# EAGLE design traffic_signals (EAGLE 9.6.2)
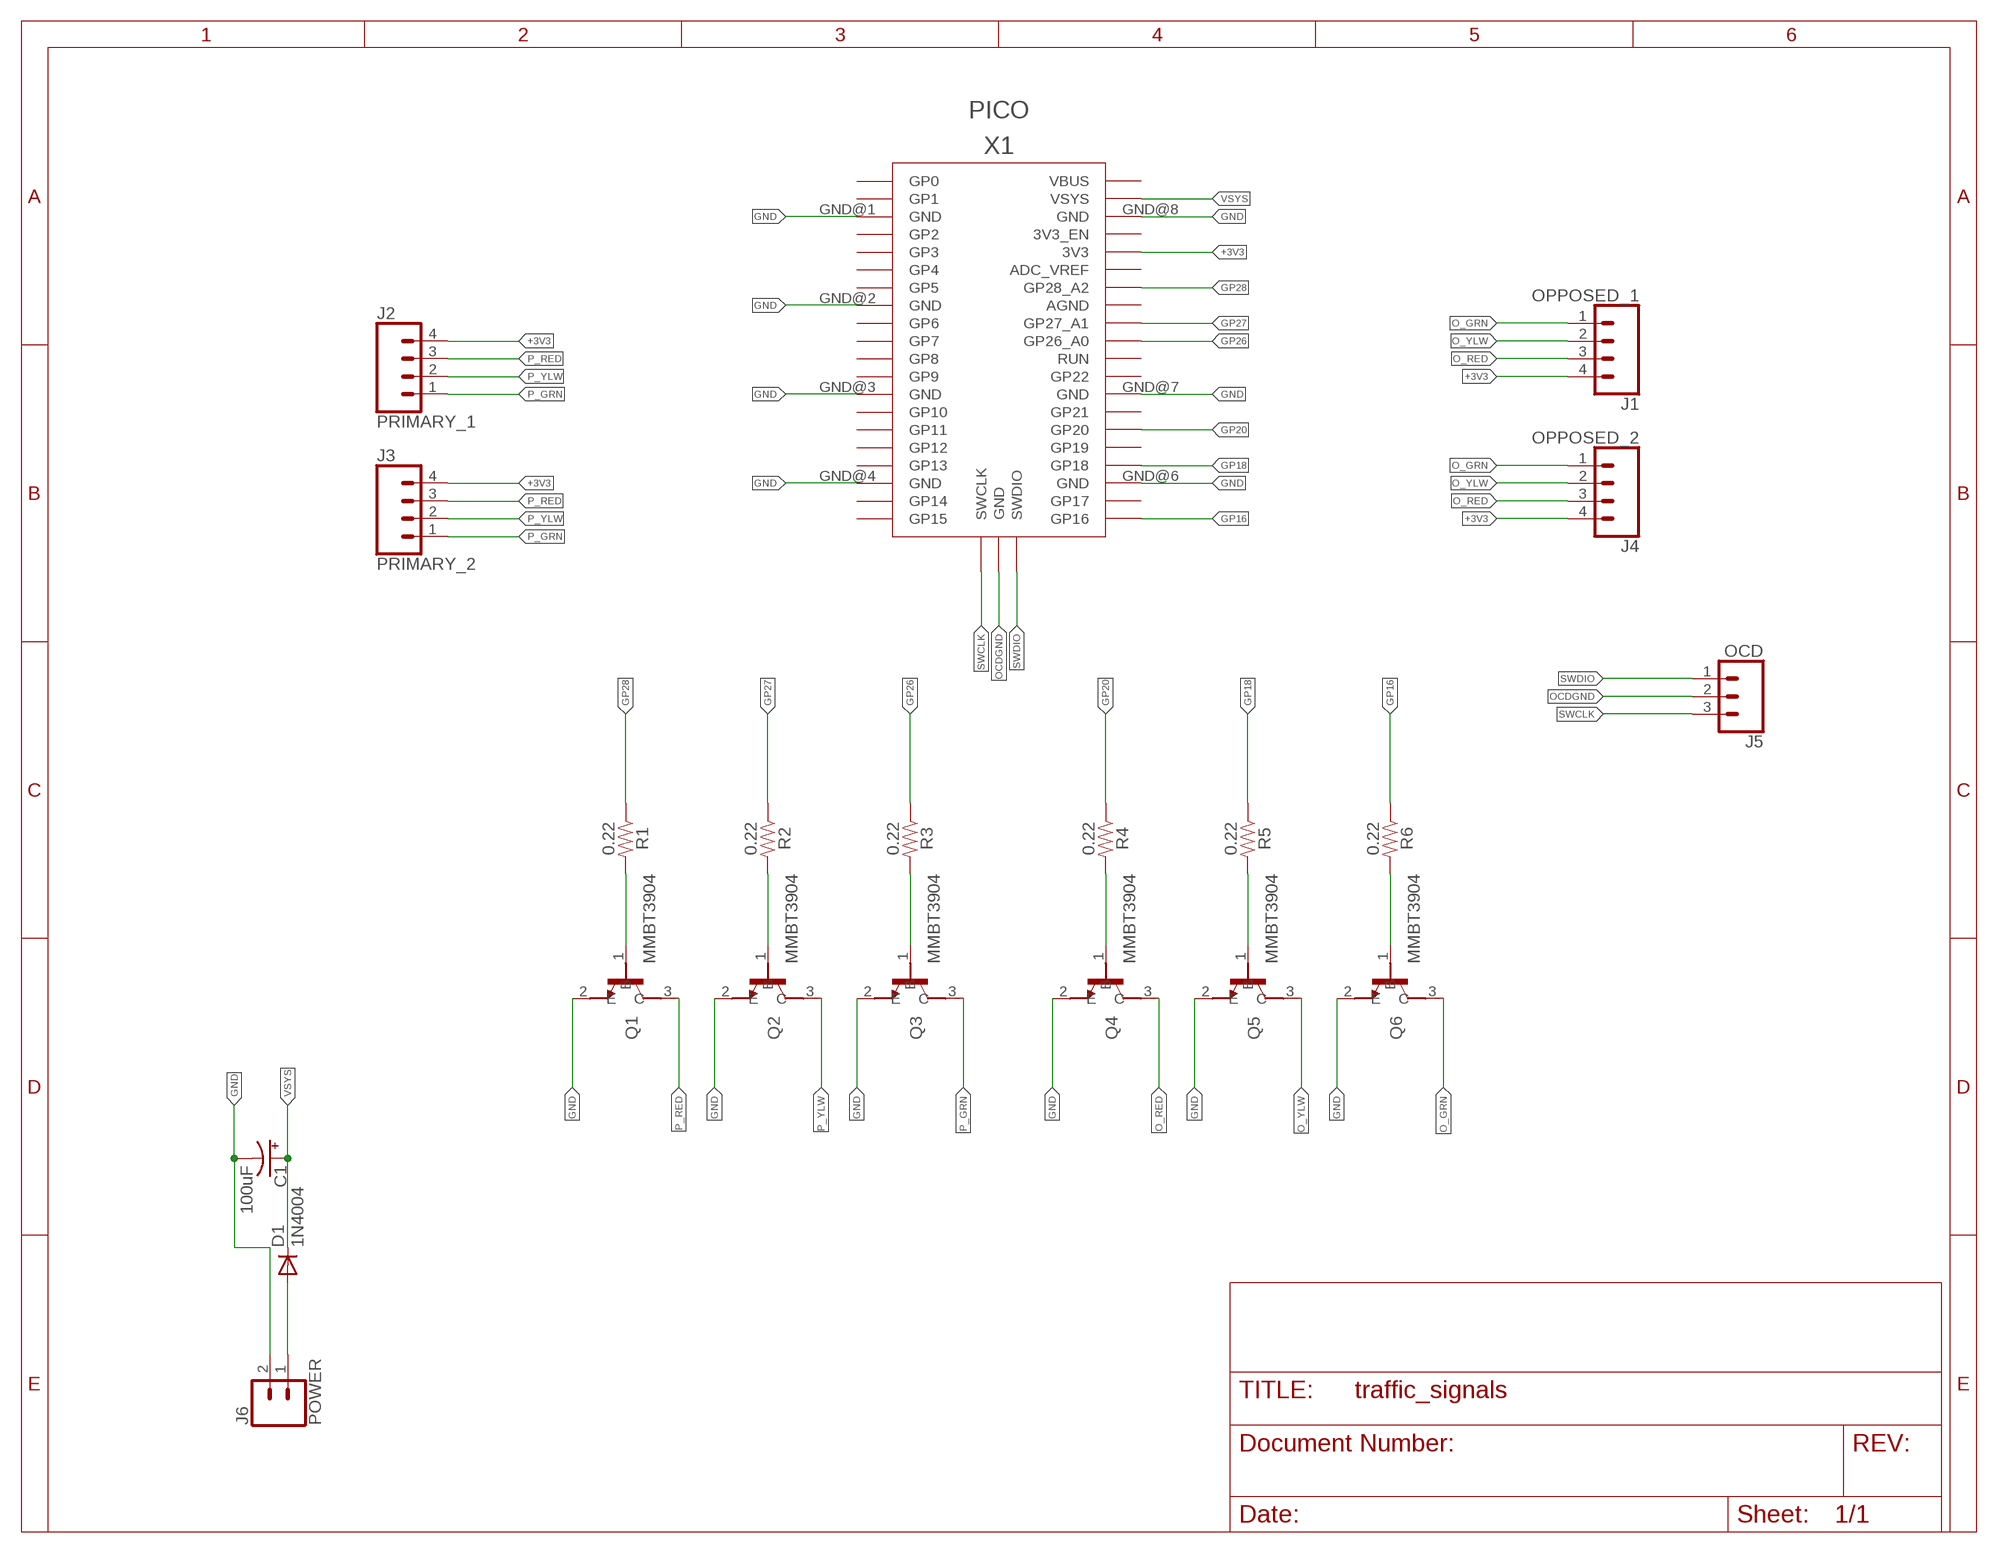
[diagram p0: schematic, sheet 1]

## Parts
C1  100uF  100UF-POLAR-RADIAL-2.5MM-25V-20%  [CPOL-RADIAL-2.5MM-6.5MM]
D1  1N4004  [DO41-10]
J1  OPPOSED_1  CONN_04  [1X04]
J2  PRIMARY_1  CONN_04  [1X04]
J3  PRIMARY_2  CONN_04  [1X04]
J4  OPPOSED_2  CONN_04  [1X04]
J5  OCD  CONN_03  [1X03]
J6  POWER  CONN_02  [1X02]
Q1  MMBT3904  [SOT95P240X120-3N]
Q2  MMBT3904  [SOT95P240X120-3N]
Q3  MMBT3904  [SOT95P240X120-3N]
Q4  MMBT3904  [SOT95P240X120-3N]
Q5  MMBT3904  [SOT95P240X120-3N]
Q6  MMBT3904  [SOT95P240X120-3N]
R1  0.22  0.22OHM-0805-1/4W-1%  [0805]
R2  0.22  0.22OHM-0805-1/4W-1%  [0805]
R3  0.22  0.22OHM-0805-1/4W-1%  [0805]
R4  0.22  0.22OHM-0805-1/4W-1%  [0805]
R5  0.22  0.22OHM-0805-1/4W-1%  [0805]
R6  0.22  0.22OHM-0805-1/4W-1%  [0805]
X1  PICO  RPI_PICO_IG-TH  [RPI_PICO_TH]

## Nets
+3V3: J1.4 J2.4 J3.4 J4.4 X1.3V3
GND: C1.2(-) J6.2 Q1.2(E) Q2.2(E) Q3.2(E) Q4.2(E) Q5.2(E) Q6.2(E) X1.GND@1(GND) X1.GND@2(GND) X1.GND@3(GND) X1.GND@4(GND) X1.GND@6(GND) X1.GND@7(GND) X1.GND@8(GND)
GP16: R6.1 X1.GP16
GP18: R5.1 X1.GP18
GP20: R4.1 X1.GP20
GP26: R3.1 X1.GP26_A0
GP27: R2.1 X1.GP27_A1
GP28: R1.1 X1.GP28_A2
N$2: D1.A J6.1
N$7: Q1.1(B) R1.2
N$8: Q2.1(B) R2.2
N$9: Q3.1(B) R3.2
N$10: Q4.1(B) R4.2
N$11: Q5.1(B) R5.2
N$12: Q6.1(B) R6.2
O_GRN: J1.1 J4.1 Q6.3(C)
O_RED: J1.3 J4.3 Q4.3(C)
O_YLW: J1.2 J4.2 Q5.3(C)
OCDGND: J5.2 X1.GND@5(GND)
P_GRN: J2.1 J3.1 Q3.3(C)
P_RED: J2.3 J3.3 Q1.3(C)
P_YLW: J2.2 J3.2 Q2.3(C)
SWCLK: J5.3 X1.SWCLK
SWDIO: J5.1 X1.SWDIO
VSYS: C1.1(+) D1.C X1.VSYS
Unconnected: X1.3V3_EN X1.ADC_VREF X1.AGND X1.GP0 X1.GP1 X1.GP2 X1.GP3 X1.GP4 X1.GP5 X1.GP6 X1.GP7 X1.GP8 X1.GP9 X1.GP10 X1.GP11 X1.GP12 X1.GP13 X1.GP14 X1.GP15 X1.GP17 X1.GP19 X1.GP21 X1.GP22 X1.RUN X1.VBUS

## Library data of the parts
C1 = SparkFun-Capacitors:100UF-POLAR: 100µF polarized capacitors A capacitor is a passive two-terminal electrical component used to store electrical energy temporarily in an electric field.; PROD_ID: CAP-08439
D1 = adafruit:1N4004: DIODE General purpose 1N400x type rectifier (With bigger pads) http://www.ladyada.net/library/pcb/eaglelibrary.html
J1-J4 = SparkFun-Connectors:CONN_04: Multi connection point. Often used as Generic Header-pin footprint for 0.1 inch spaced/style header connections On any of the 0.1 inch spaced packages, you can populate with these: Break Away Headers - Straight <https://www.sparkfun.com/products/116> (PRT-00116) Break Away Male Headers - Right Angle <https://www.sparkfun.com/products/553> (PRT-00553) Female Headers <https://www.sparkfun.com/products/115> (PRT-00115) Break Away Headers - Machine Pin <https://www.sparkfun.com/products/117> (PRT-00117) Break Away Female Headers - Swiss Machine Pin <https://www.sparkfun.com/products/743> (PRT-00743) For SCREWTERMINALS and SPRING TERMINALS visit here: Screw Terimnals on SparkFun.com <https://www.sparkfun.com/search/results?term=Screw+Terminals> (5mm/3.5mm/2.54mm spacing) This device is also useful as a general connection point to wire up your design to another part of your project. Our various solder wires solder well into these plated through hole pads. Hook-Up Wire - Assortment (Stranded, 22 AWG) <https://www.sparkfun.com/products/11375> (PRT-11375) Hook-Up Wire - Assortment (Solid Core, 22 AWG) <https://www.sparkfun.com/products/11367> (PRT-11367) View the entire wire category on our website here <https://www.sparkfun.com/categories/141> Special notes: Molex polarized connector foot print use with SKU : PRT-08231 with associated crimp pins and housings. 1MM SMD Version SKU: PRT-10208; PROD_ID: CONN-09696
J5 = SparkFun-Connectors:CONN_03: Multi connection point. Often used as Generic Header-pin footprint for 0.1 inch spaced/style header connections On any of the 0.1 inch spaced packages, you can populate with these: Break Away Headers - Straight <https://www.sparkfun.com/products/116> (PRT-00116) Break Away Male Headers - Right Angle <https://www.sparkfun.com/products/553> (PRT-00553) Female Headers <https://www.sparkfun.com/products/115> (PRT-00115) Break Away Headers - Machine Pin <https://www.sparkfun.com/products/117> (PRT-00117) Break Away Female Headers - Swiss Machine Pin <https://www.sparkfun.com/products/743> (PRT-00743) Stackable Header - 3 Pin (Female, 0.1") <https://www.sparkfun.com/products/13875> (PRT-13875) For SCREWTERMINALS and SPRING TERMINALS visit here: Screw Terimnals on SparkFun.com <https://www.sparkfun.com/search/results?term=Screw+Terminals> (5mm/3.5mm/2.54mm spacing) This device is also useful as a general connection point to wire up your design to another part of your project. Our various solder wires solder well into these plated through hole pads. Hook-Up Wire - Assortment (Stranded, 22 AWG) <https://www.sparkfun.com/products/11375> (PRT-11375) Hook-Up Wire - Assortment (Solid Core, 22 AWG) <https://www.sparkfun.com/products/11367> (PRT-11367) View the entire wire category on our website here <https://www.sparkfun.com/categories/141> Special notes: Molex polarized connector foot print use with SKU : PRT-08232 with associated crimp pins and housings.
J6 = SparkFun-Connectors:CONN_02: Multi connection point. Often used as Generic Header-pin footprint for 0.1 inch spaced/style header connections On any of the 0.1 inch spaced packages, you can populate with these: Break Away Headers - Straight <https://www.sparkfun.com/products/116> (PRT-00116) Break Away Male Headers - Right Angle <https://www.sparkfun.com/products/553> (PRT-00553) Female Headers <https://www.sparkfun.com/products/115> (PRT-00115) Break Away Headers - Machine Pin <https://www.sparkfun.com/products/117> (PRT-00117) Break Away Female Headers - Swiss Machine Pin <https://www.sparkfun.com/products/743> (PRT-00743) For SCREWTERMINALS and SPRING TERMINALS visit here: Screw Terimnals on SparkFun.com <https://www.sparkfun.com/search/results?term=Screw+Terminals> (5mm/3.5mm/2.54mm spacing) This device is also useful as a general connection point to wire up your design to another part of your project. Our various solder wires solder well into these plated through hole pads. Hook-Up Wire - Assortment (Stranded, 22 AWG) <https://www.sparkfun.com/products/11375> (PRT-11375) Hook-Up Wire - Assortment (Solid Core, 22 AWG) <https://www.sparkfun.com/products/11367> (PRT-11367) View the entire wire category on our website here <https://www.sparkfun.com/categories/141> Special notes: Molex polarized connector foot print use with: PRT-08233 with associated crimp pins and housings. 2.54_SCREWTERM for use with PRT-10571. 3.5mm Screw Terminal footprints for PRT-08084 5mm Screw Terminal footprints for use with PRT-08432
Q1-Q6 = MMBT3904:MMBT3904: MMBT3904 Series 40 V CE Breakdown 0.2 A NPN General Purpose Amplifier - SOT-23 Check prices <https://pricing.snapeda.com/parts/MMBT3904/STMicroelectronics/view-part?ref=eda>; AVAILABILITY: Bad; DESCRIPTION: Bipolar (BJT) Transistor NPN 40V 200mA 300MHz 300mW Surface Mount SOT-23-3; MF: STMicroelectronics; MP: MMBT3904; PACKAGE: SOT-23-3 Taiwan Semiconductor; PRICE: None
R1-R6 = SparkFun-Resistors:0.22OHM: 0.22Ω resistor A resistor is a passive two-terminal electrical component that implements electrical resistance as a circuit element. Resistors act to reduce current flow, and, at the same time, act to lower voltage levels within circuits. - Wikipedia; PROD_ID: RES-09883
X1 = RaspberryPi_Pico:RPI_PICO_IG

## Board
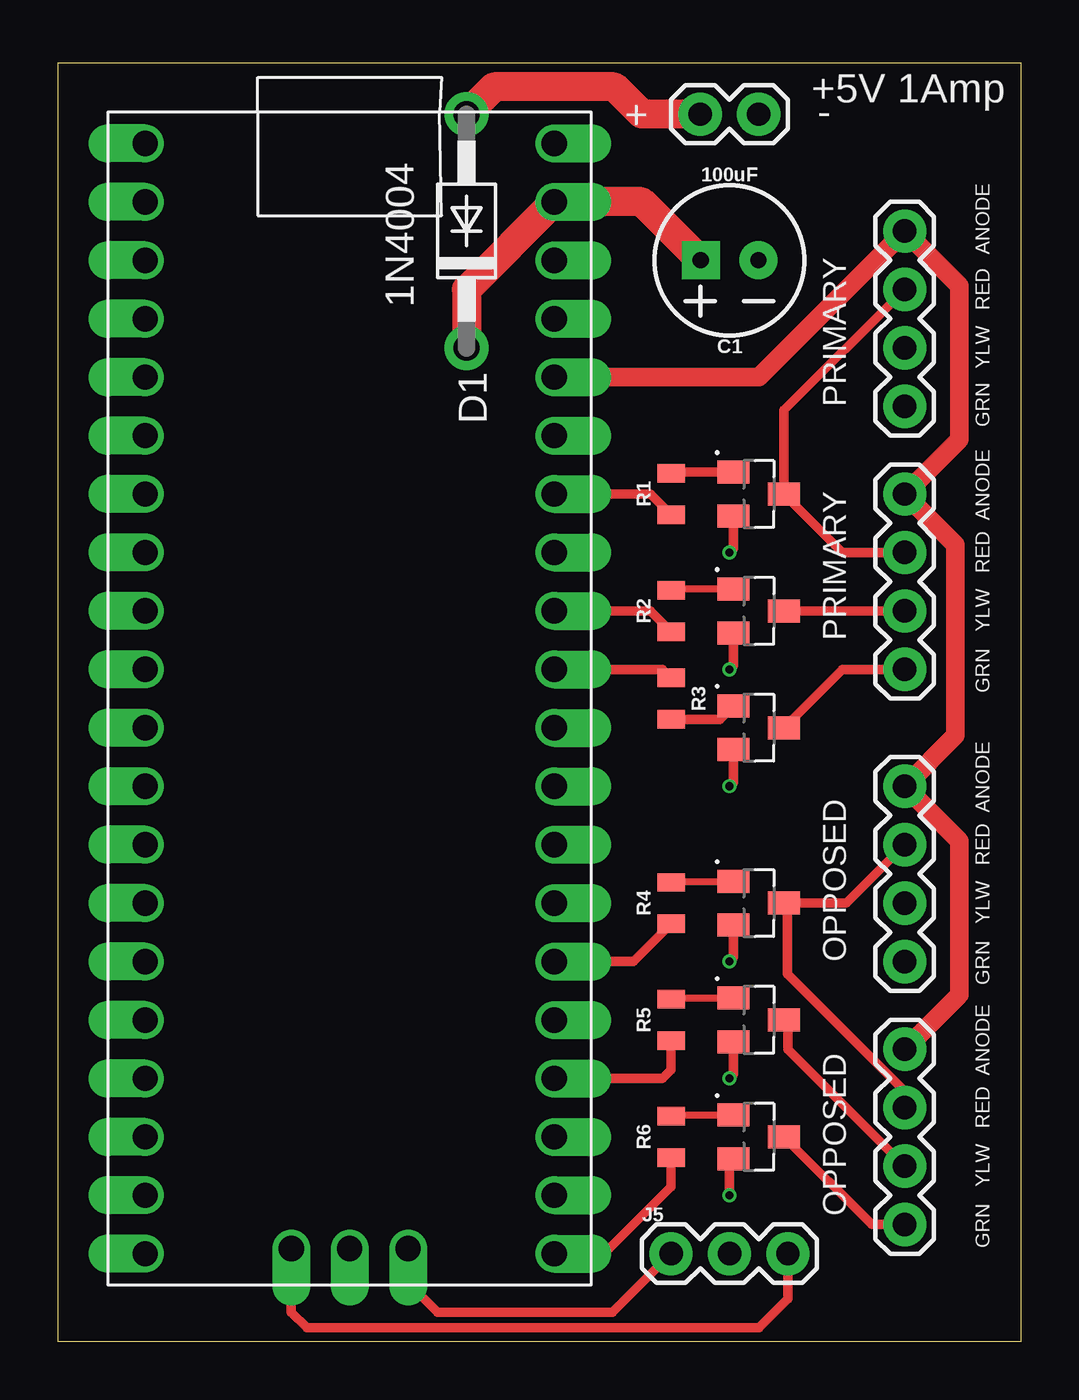
[diagram p1: board, top side]
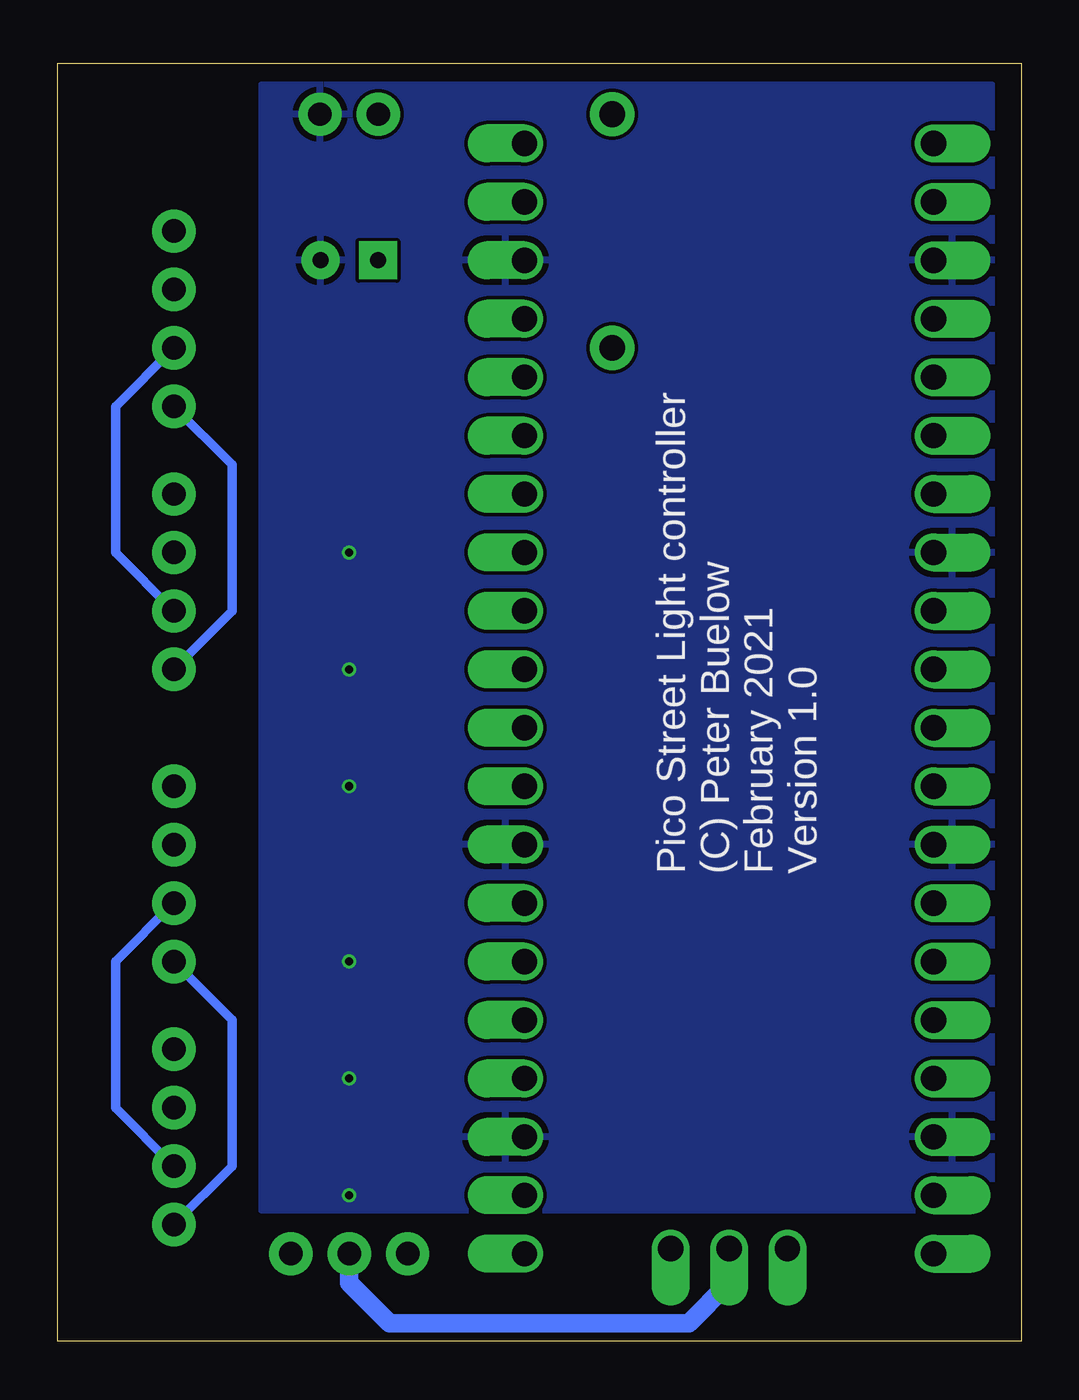
[diagram p2: board, bottom side, seen from below]

Size 41.89 x 55.55 mm. Coordinates in mm from the lower left corner, seen from the top.
Outline: 0,0 41.89,0 41.89,55.55 0,55.55 0,0
Copper layers (1*16): Top 0.035559375mm / dielectric 1.6mm / Bottom 0.035559375mm
Design rules "oshpark-2layer": minimum track width 6mil, minimum drill 10mil, track to track 6mil, track to pad 6mil, pad to pad 6mil, via to via 6mil, smd to smd 6mil, copper to edge 15mil, drill to drill 6mil, minimum pad ring 5mil, minimum via ring 5mil, stop-mask expansion 2.5mil, vias tented up to drill 0mil, thermal gap 10mil

### Footprints (pad centres in the part's own frame; a part is rotated, then mirrored left to right if it is on the bottom)
CPOL-RADIAL-2.5MM-6.5MM = drill 0.7 pad 1.651 square: 1 1.25,0 | drill 0.7 pad 1.651: 2 -1.25,0
DO41-10 = drill 1.118 pad 1.93: A 5.08,0; C -5.08,0
1X04 = drill 1.016 pad 1.88: 1 0,0; 2 2.54,0; 3 5.08,0; 4 7.62,0
1X03 = drill 1.016 pad 1.88: 1 0,0; 2 2.54,0; 3 5.08,0
1X02 = drill 1.016 pad 1.88: 1 0,0; 2 2.54,0
SOT95P240X120-3N = smd 1 x 1.4: 1 -0.95,-1.1; 2 0.95,-1.1; 3 0,1.1
0805 = smd 0.8 x 1.2: 1 -0.9,0; 2 0.9,0
RPI_PICO_TH = drill 1.1 pad 1.6 offset: 3V3 8.89,13.97; 3V3_EN 8.89,16.51; ADC_VREF 8.89,11.43; AGND 8.89,6.35; GND@1 -8.89,19.05; GND@2 -8.89,6.35; GND@3 -8.89,-6.35; GND@4 -8.89,-19.05; GND@5 0,-23.9; GND@6 8.89,-19.05; GND@7 8.89,-6.35; GND@8 8.89,19.05; GP0 -8.89,24.13; GP1 -8.89,21.59; GP2 -8.89,16.51; GP3 -8.89,13.97; GP4 -8.89,11.43; GP5 -8.89,8.89; GP6 -8.89,3.81; GP7 -8.89,1.27; GP8 -8.89,-1.27; GP9 -8.89,-3.81; GP10 -8.89,-8.89; GP11 -8.89,-11.43; GP12 -8.89,-13.97; GP13 -8.89,-16.51; GP14 -8.89,-21.59; GP15 -8.89,-24.13; GP16 8.89,-24.13; GP17 8.89,-21.59; GP18 8.89,-16.51; GP19 8.89,-13.97; GP20 8.89,-11.43; GP21 8.89,-8.89; GP22 8.89,-3.81; GP26_A0 8.89,1.27; GP27_A1 8.89,3.81; GP28_A2 8.89,8.89; RUN 8.89,-1.27; SWCLK -2.54,-23.9; SWDIO 2.54,-23.9; VBUS 8.89,24.13; VSYS 8.89,21.59

### Placement (x,y rotation side)
C1  29.21,46.99 180 top
D1  17.78,48.26 90 top
J1  36.83,5.08 90 top
J2  36.83,29.21 90 top
J3  36.83,40.64 90 top
J4  36.83,16.51 90 top
J5  26.67,3.81 0 top
J6  27.94,53.34 0 top
Q1  30.48,36.83 270 top
Q2  30.48,31.75 270 top
Q3  30.48,26.67 270 top
Q4  30.48,19.05 270 top
Q5  30.48,13.97 270 top
Q6  30.48,8.89 270 top
R1  26.67,36.83 90 top
R2  26.67,31.75 90 top
R3  26.67,27.94 270 top
R4  26.67,19.05 90 top
R5  26.67,13.97 90 top
R6  26.67,8.89 90 top
X1  12.7,27.94 0 top

### Tracks (layer width: path | path; a pad name or v marks a point on that pad's centre or on a via)
+3V3
  Top 0.813: J1.4 39.2,15.07 39.2,21.76 J4.4 39.02,26.32 39.02,34.63 J2.4 39.2,39.2 39.2,45.89 J3.4 30.48,41.91 X1.3V3
GND  (via drill 0.35)
  Top 0.406: Q1.2 29.38,34.46 v29.21,34.29 | Q2.2 29.38,29.38 v29.21,29.21 | Q3.2 29.38,24.3 v29.21,24.13 | Q4.2 29.38,16.68 v29.21,16.51 | Q5.2 29.38,11.6 v29.21,11.43 | v29.21,6.35 29.21,7.77 Q6.2
  pour Bottom: 1.27,54.61 33.02,54.61 33.02,5.71 1.27,5.71
GP16
  Top 0.406: X1.GP16 23.76,3.81 26.67,6.72 R6.1
GP18
  Top 0.406: R5.1 26.67,11.8 26.3,11.43 X1.GP18
GP20
  Top 0.406: R4.1 25.03,16.51 X1.GP20
GP26
  Top 0.406: R3.1 26.3,29.21 X1.GP26_A0
GP27
  Top 0.406: R2.1 25.77,31.75 X1.GP27_A1
GP28
  Top 0.406: R1.1 25.77,36.83 X1.GP28_A2
N$2
  Top 1.27: J6.1 25.4,53.34 24.21,54.53 18.97,54.53 D1.A
N$7
  Top 0.406: Q1.1 26.72,37.78 R1.2
N$8
  Top 0.305: Q2.1 26.72,32.7 R2.2
N$9
  Top 0.406: R3.2 28.8,27.04 Q3.1
N$10
  Top 0.305: R4.2 26.72,20 Q4.1
N$11
  Top 0.305: R5.2 26.72,14.92 Q5.1
N$12
  Top 0.305: R6.2 26.72,9.84 Q6.1
O_GRN
  Top 0.406: Q6.3 35.39,5.08 J1.1
  Bottom 0.406: J4.1 34.29,13.97 34.29,7.62 J1.1
O_RED
  Top 0.406: J1.3 36.83,10.87 31.73,15.97 31.73,18.91 Q4.3 34.29,19.05 J4.3
O_YLW
  Top 0.406: Q5.3 31.75,13.8 31.75,12.7 J1.2
  Bottom 0.406: J4.2 39.37,16.51 39.37,10.16 J1.2
OCDGND
  Bottom 0.813: J5.2 29.21,2.54 27.46,0.79 14.45,0.79 12.7,2.54 X1.GND@5
P_GRN
  Top 0.406: Q3.3 34.12,29.21 J2.1
  Bottom 0.406: J3.1 34.29,38.1 34.29,31.75 J2.1
P_RED
  Top 0.406: J2.3 34.12,34.29 Q1.3 31.58,40.47 J3.3
P_YLW
  Top 0.406: J2.2 Q2.3
  Bottom 0.406: J3.2 39.37,40.64 39.37,34.29 J2.2
SWCLK
  Top 0.406: X1.SWCLK 10.16,1.27 10.85,0.58 30.48,0.58 31.75,1.85 J5.3
SWDIO
  Top 0.406: J5.1 24.13,1.27 16.51,1.27 15.24,2.54 X1.SWDIO
VSYS
  Top 1.27: C1.1 27.94,46.99 25.4,49.53 X1.VSYS 17.78,45.72 D1.C

### Text on the board
_tsilk: +5V 1Amp | + | - | ANODE | RED | YLW | PRIMARY | GRN | ANODE | RED | YLW | PRIMARY | GRN | ANODE | RED | YLW | OPPOSED | GRN | ANODE | RED | YLW | OPPOSED | GRN
_bsilk: Pico Street Light controller / (C) Peter Buelow / February 2021 / Version 1.0